# EAGLE design main board (EAGLE 7.1.0)
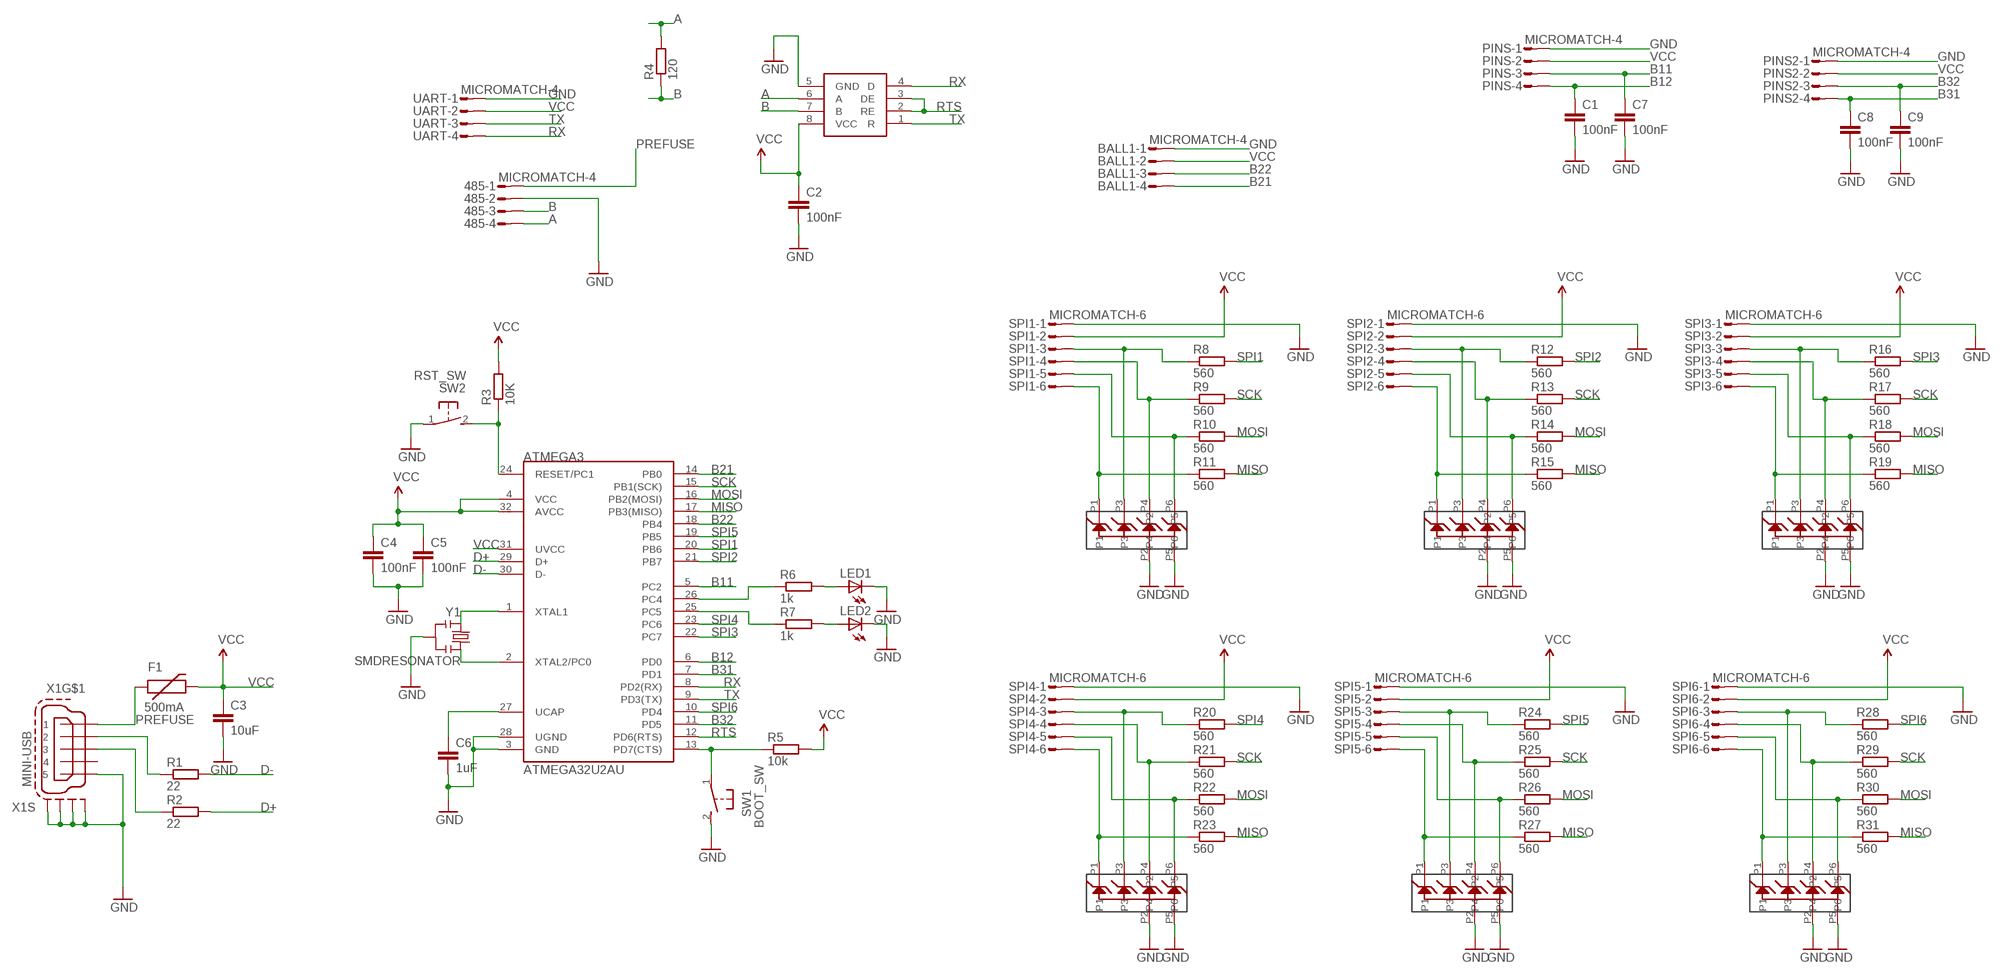
[diagram p0: schematic, sheet 1]

## Parts
485  MICROMATCH-4  [MICROMATCH-4]
ATMEGA3  ATMEGA32U2AU  ATMEGA8U2AU  [TQFP32-08]
BALL1  MICROMATCH-4  [MICROMATCH-4]
C1  100nF  C-EUC0603  [C0603]
C2  100nF  C-EUC0603  [C0603]
C3  10uF  C-EUC1206K  [C1206K]
C4  100nF  C-EUC0603  [C0603]
C5  100nF  C-EUC0603  [C0603]
C6  1uF  C-EUC0603  [C0603]
C7  100nF  C-EUC0603  [C0603]
C8  100nF  C-EUC0603  [C0603]
C9  100nF  C-EUC0603  [C0603]
F1  500mA  PTCSMD  [PTC-1206]
LED1  LEDCHIP-LED0603  [CHIP-LED0603]
LED2  LEDCHIP-LED0603  [CHIP-LED0603]
PINS  MICROMATCH-4  [MICROMATCH-4]
PINS2  MICROMATCH-4  [MICROMATCH-4]
R1  22  R-EU_R0603  [R0603]
R2  22  R-EU_R0603  [R0603]
R3  10K  R-EU_R0603  [R0603]
R4  120  R-EU_R0603  [R0603]
R5  10k  R-EU_R0603  [R0603]
R6  1k  R-EU_R0603  [R0603]
R7  1k  R-EU_R0603  [R0603]
R8  560  R-EU_R0603  [R0603]
R9  560  R-EU_R0603  [R0603]
R10  560  R-EU_R0603  [R0603]
R11  560  R-EU_R0603  [R0603]
R12  560  R-EU_R0603  [R0603]
R13  560  R-EU_R0603  [R0603]
R14  560  R-EU_R0603  [R0603]
R15  560  R-EU_R0603  [R0603]
R16  560  R-EU_R0603  [R0603]
R17  560  R-EU_R0603  [R0603]
R18  560  R-EU_R0603  [R0603]
R19  560  R-EU_R0603  [R0603]
R20  560  R-EU_R0603  [R0603]
R21  560  R-EU_R0603  [R0603]
R22  560  R-EU_R0603  [R0603]
R23  560  R-EU_R0603  [R0603]
R24  560  R-EU_R0603  [R0603]
R25  560  R-EU_R0603  [R0603]
R26  560  R-EU_R0603  [R0603]
R27  560  R-EU_R0603  [R0603]
R28  560  R-EU_R0603  [R0603]
R29  560  R-EU_R0603  [R0603]
R30  560  R-EU_R0603  [R0603]
R31  560  R-EU_R0603  [R0603]
SPI1  MICROMATCH-6  [MICROMATCH-6]
SPI2  MICROMATCH-6  [MICROMATCH-6]
SPI3  MICROMATCH-6  [MICROMATCH-6]
SPI4  MICROMATCH-6  [MICROMATCH-6]
SPI5  MICROMATCH-6  [MICROMATCH-6]
SPI6  MICROMATCH-6  [MICROMATCH-6]
SW1  BOOT_SW  SMD-TACT-3.9X2.9  [SMD-TACT-3.9X2.9]
SW2  RST_SW  SMD-TACT-3.9X2.9  [SMD-TACT-3.9X2.9]
U$1  ESDAXX6LSS  [ESDAXX6L]
U$2  ESDAXX6LSS  [ESDAXX6L]
U$3  ESDAXX6LSS  [ESDAXX6L]
U$4  ESDAXX6LSS  [ESDAXX6L]
U$5  ESDAXX6LSS  [ESDAXX6L]
U$6  ESDAXX6LSS  [ESDAXX6L]
U$7  SN75176BPSR  [SOIC]
UART  MICROMATCH-4  [MICROMATCH-4]
X1  MINI-USB  MINI-USB-SCHIELD-32005-301  [32005-301]
Y1  SMDRESONATOR  SMDRESONATOR45X20  [PBRC-M]

## Nets
A: 485.4 R4.2 U$7.6(A)
B: 485.3 R4.1 U$7.7(B)
B11: ATMEGA3.5(PC2) C7.1 PINS.3
B12: ATMEGA3.6(PD0) C1.1 PINS.4
B21: ATMEGA3.14(PB0) BALL1.4
B22: ATMEGA3.18(PB4) BALL1.3
B31: ATMEGA3.7(PD1) C8.1 PINS2.4
B32: ATMEGA3.11(PD5) C9.1 PINS2.3
D+: ATMEGA3.29(D+) R2.2
D-: ATMEGA3.30(D-) R1.2
GND: 485.2 ATMEGA3.3(GND) ATMEGA3.28(UGND) BALL1.1 C1.2 C2.2 C3.2 C4.2 C5.2 C6.2 C7.2 C8.2 C9.2 LED1.C LED2.C PINS2.1 PINS.1 SPI1.1 SPI2.1 SPI3.1 SPI4.1 SPI5.1 SPI6.1 SW1.2 SW2.1 U$1.P2 U$1.P5 U$2.P2 U$2.P5 U$3.P2 U$3.P5 U$4.P2 U$4.P5 U$5.P2 U$5.P5 U$6.P2 U$6.P5 U$7.5(GND) UART.1 X1.5 X1.M1(S:S1) X1.M2(S:S2) X1.M3(S:S3) X1.M4(S:S4) Y1.2
MISO: ATMEGA3.17(PB3(MISO)) R11.2 R15.2 R19.2 R23.2 R27.2 R31.2
MOSI: ATMEGA3.16(PB2(MOSI)) R10.2 R14.2 R18.2 R22.2 R26.2 R30.2
N$2: R2.1 X1.3
N$3: R1.1 X1.2
N$5: ATMEGA3.1(XTAL1) Y1.1
N$6: ATMEGA3.2(XTAL2/PC0) Y1.3
N$7: ATMEGA3.13(PD7(CTS)) R5.1 SW1.1
N$8: ATMEGA3.24(RESET/PC1) R3.1 SW2.2
N$9: R12.1 SPI2.3 U$2.P3
N$10: R13.1 SPI2.4 U$2.P4
N$11: ATMEGA3.25(PC5) R7.1
N$12: ATMEGA3.27(UCAP) C6.1
N$13: ATMEGA3.26(PC4) R6.1
N$14: LED1.A R6.2
N$15: LED2.A R7.2
N$16: R8.1 SPI1.3 U$1.P3
N$17: R9.1 SPI1.4 U$1.P4
N$18: R10.1 SPI1.5 U$1.P6
N$19: R11.1 SPI1.6 U$1.P1
N$20: R14.1 SPI2.5 U$2.P6
N$21: R15.1 SPI2.6 U$2.P1
N$22: R16.1 SPI3.3 U$3.P3
N$23: R17.1 SPI3.4 U$3.P4
N$24: R18.1 SPI3.5 U$3.P6
N$25: R19.1 SPI3.6 U$3.P1
N$26: R20.1 SPI4.3 U$4.P3
N$27: R21.1 SPI4.4 U$4.P4
N$28: R22.1 SPI4.5 U$4.P6
N$29: R23.1 SPI4.6 U$4.P1
N$30: R24.1 SPI5.3 U$5.P3
N$31: R25.1 SPI5.4 U$5.P4
N$32: R26.1 SPI5.5 U$5.P6
N$33: R27.1 SPI5.6 U$5.P1
N$34: R28.1 SPI6.3 U$6.P3
N$35: R29.1 SPI6.4 U$6.P4
N$36: R30.1 SPI6.5 U$6.P6
N$37: R31.1 SPI6.6 U$6.P1
PREFUSE: 485.1 F1.1 X1.1
RTS: ATMEGA3.12(PD6(RTS)) U$7.2(RE) U$7.3(DE)
RX: ATMEGA3.8(PD2(RX)) U$7.4(D) UART.4
SCK: ATMEGA3.15(PB1(SCK)) R9.2 R13.2 R17.2 R21.2 R25.2 R29.2
SPI1: ATMEGA3.20(PB6) R8.2
SPI2: ATMEGA3.21(PB7) R12.2
SPI3: ATMEGA3.22(PC7) R16.2
SPI4: ATMEGA3.23(PC6) R20.2
SPI5: ATMEGA3.19(PB5) R24.2
SPI6: ATMEGA3.10(PD4) R28.2
TX: ATMEGA3.9(PD3(TX)) U$7.1(R) UART.3
VCC: ATMEGA3.4(VCC) ATMEGA3.31(UVCC) ATMEGA3.32(AVCC) BALL1.2 C2.1 C3.1 C4.1 C5.1 F1.2 PINS2.2 PINS.2 R3.2 R5.2 SPI1.2 SPI2.2 SPI3.2 SPI4.2 SPI5.2 SPI6.2 U$7.8(VCC) UART.2
Unconnected: X1.4

## Library data of the parts
485 BALL1 PINS PINS2 UART = con-amp-micromatch:MICROMATCH-4: MicroMaTch 4 7-215464-4 / 0-215464-4 Drawing Number C-215464 DDEController.pdf; MPN: 7-215464-4; OC_FARNELL: 3784629; OC_NEWARK: 19R8124
ATMEGA3 = SparkFun:ATMEGA8U2: Atmel 8-bit Microcontroller with 8/16/32K Bystes of ISP Flash and USB Controller. ATmega8U2, ATmega16U2, and ATmega32U2
C1-C9 = rcl:C-EU: CAPACITOR, European symbol
F1 = SparkFun-PowerIC:PTC: Resettable Fuse PTC Resettable Fuse. Spark Fun Electronics SKU : COM-08357; PROD_ID: RES-11150
LED1 LED2 = led:LED: LED OSRAM: - CHIPLED LG R971, LG N971, LY N971, LG Q971, LY Q971, LO R971, LY R971 LH N974, LH R974 LS Q976, LO Q976, LY Q976 LO Q996 - Hyper CHIPLED LW Q18S LB Q993, LB Q99A, LB R99A - SideLED LS A670, LO A670, LY A670, LG A670, LP A670 LB A673, LV A673, LT A673, LW A673 LH A674 LY A675 LS A676, LA A676, LO A676, LY A676, LW A676 LS A679, LY A679, LG A679 - Hyper Micro SIDELED® LS Y876, LA Y876, LO Y876, LY Y876 LT Y87S - SmartLED LW L88C, LW L88S LB L89C, LB L89S, LG L890 LS L89K, LO L89K, LY L89K LS L896, LA L896, LO L896, LY L896 - TOPLED LS T670, LO T670, LY T670, LG T670, LP T670 LSG T670, LSP T670, LSY T670, LOP T670, LYG T670 LG T671, LOG T671, LSG T671 LB T673, LV T673, LT T673, LW T673 LH T674 LS T676, LA T676, LO T676, LY T676, LB T676, LH T676, LSB T676, LW T676 LB T67C, LV T67C, LT T67C, LS T67K, LO T67K, LY T67K, LW E67C LS E67B, LA E67B, LO E67B, LY E67B, LB E67C, LV E67C, LT E67C LW T67C LS T679, LY T679, LG T679 LS T770, LO T770, LY T770, LG T770, LP T770 LB T773, LV T773, LT T773, LW T773 LH T774 LS E675, LA E675, LY E675, LS T675 LS T776, LA T776, LO T776, LY T776, LB T776 LHGB T686 LT T68C, LB T68C - Hyper Mini TOPLED® LB M676 - Mini TOPLED Santana® LG M470 LS M47K, LO M47K, LY M47K Source: http://www.osram.convergy.de LUXEON: - LUMILED® LXK2-PW12-R00, LXK2-PW12-S00, LXK2-PW14-U00, LXK2-PW14-V00 LXK2-PM12-R00, LXK2-PM12-S00, LXK2-PM14-U00 LXK2-PE12-Q00, LXK2-PE12-R00, LXK2-PE12-S00, LXK2-PE14-T00, LXK2-PE14-U00 LXK2-PB12-K00, LXK2-PB12-L00, LXK2-PB12-M00, LXK2-PB14-N00, LXK2-PB14-P00, LXK2-PB14-Q00 LXK2-PR12-L00, LXK2-PR12-M00, LXK2-PR14-Q00, LXK2-PR14-R00 LXK2-PD12-Q00, LXK2-PD12-R00, LXK2-PD12-S00 LXK2-PH12-R00, LXK2-PH12-S00 LXK2-PL12-P00, LXK2-PL12-Q00, LXK2-PL12-R00 Source: www.luxeon.com KINGBRIGHT: KA-3528ASYC Source: www.kingbright.com
R1-R31 = rcl:R-EU_: RESISTOR, European symbol
SPI1-SPI6 = con-amp-micromatch:MICROMATCH-6: MicroMaTch 6 7-215464-6 / 0-215464-6 Drawing Number C-215464 DDEController.pdf; MPN: 7-215464-6; OC_FARNELL: 3784630; OC_NEWARK: 19R8125
SW1 SW2 = Erik:SMD-TACT-3.9X2.9: SMD Tactile switch 3.9x2.9 @ebay yayaya168
U$1-U$6 = ESDAXX:ESDAXX6LSS: P1, P3, P4, P6 are for io's P2, P5 are for GND
U$7 = Allan:SN75176BPSR
X1 = con-cypressindustries:MINI-USB-SCHIELD-: MINI USB-B Conector Source: www.cypressindustries.com; OC_FARNELL: unknown; OC_NEWARK: unknown
Y1 = reiko:SMDRESONATOR45X20

## Board
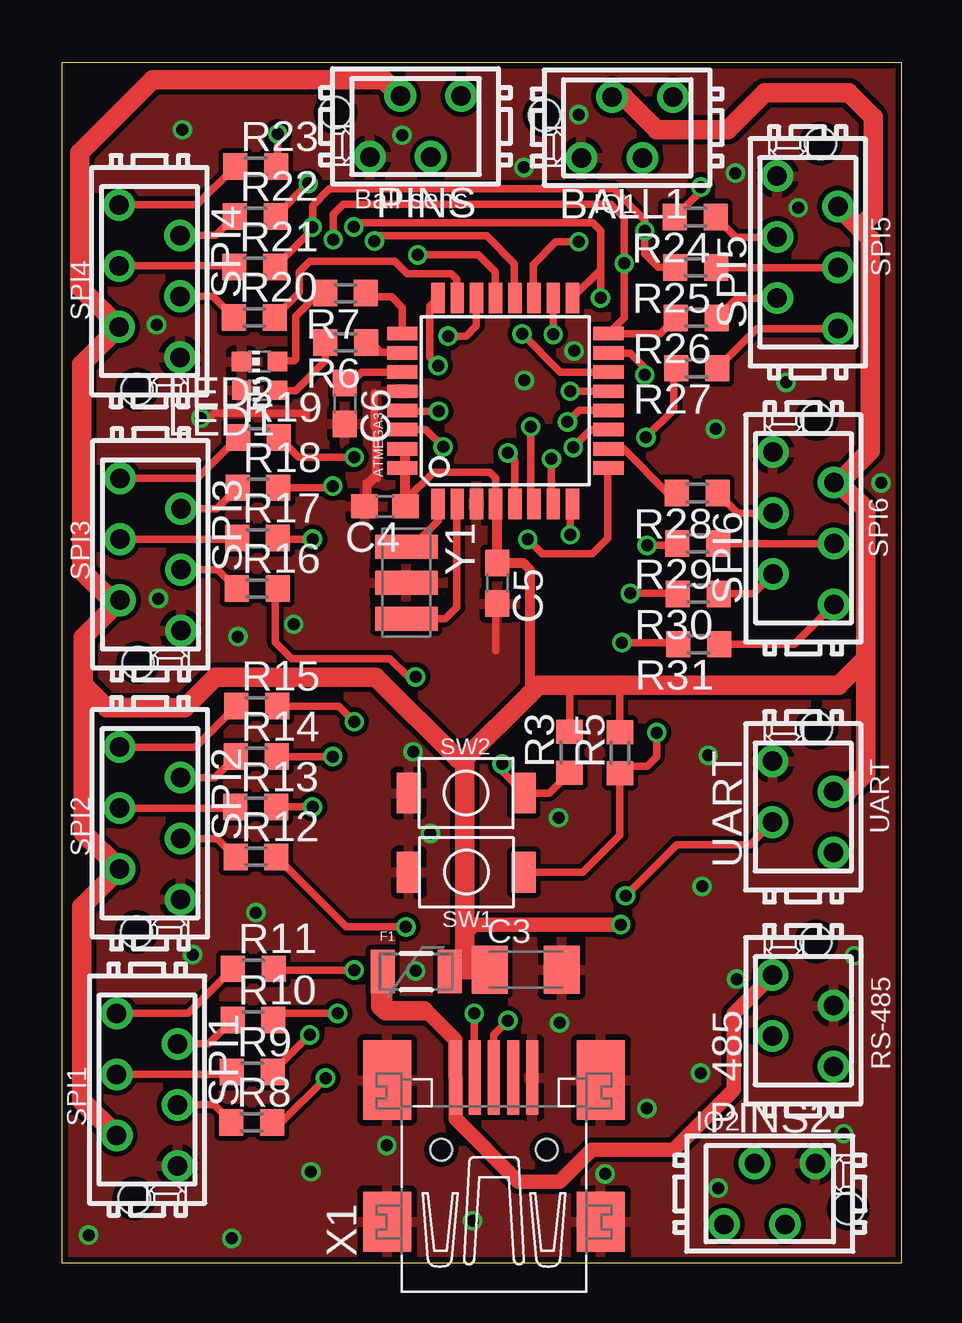
[diagram p1: board, top side]
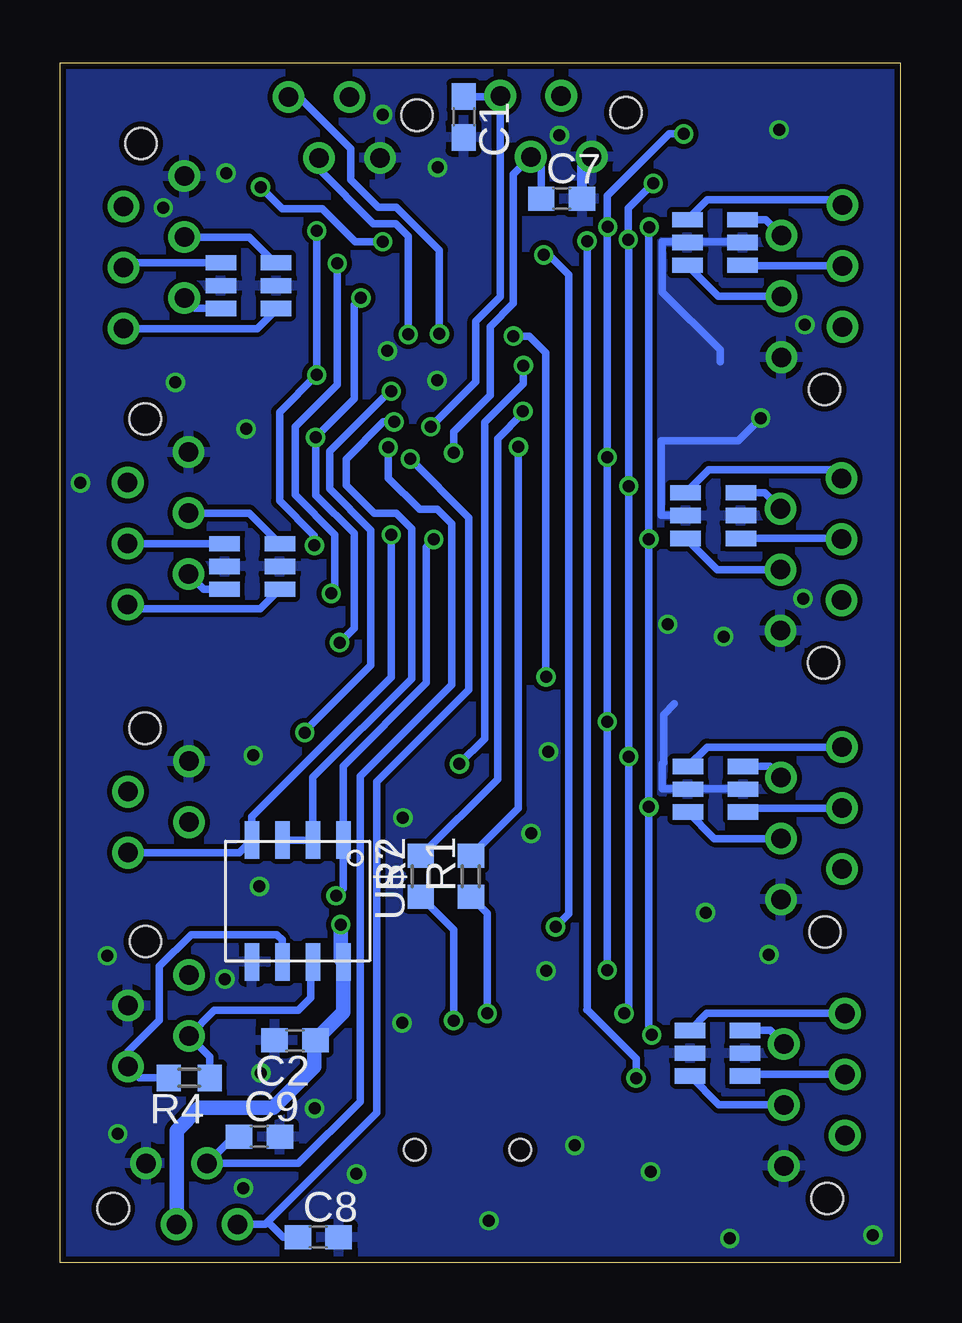
[diagram p2: board, bottom side, seen from below]

Size 35 x 50 mm. Coordinates in mm from the lower left corner, seen from the top.
Outline: 0,0 35,0 35,50 0,50 0,0
Copper layers (1*16): Top 0.035mm / dielectric 1.5mm / Bottom 0.035mm
Design rules "10mils *": minimum track width 6mil, minimum drill 12mil, track to track 8mil, track to pad 8mil, pad to pad 8mil, via to via 8mil, smd to smd 0mil, copper to edge 10mil, drill to drill 10mil, minimum pad ring 10mil, minimum via ring 6mil, stop-mask expansion 2mil, vias tented up to drill 0mil, thermal gap 10mil
Holes 1.3 mm at 31.63,46.65 31.45,35.16 31.46,22.28 31.44,13.4 3.03,2.69 3.12,13.79 3.18,25.01 3.14,36.39 20.13,47.82 11.41,47.94 32.78,2.27

### Footprints (pad centres in the part's own frame; a part is rotated, then mirrored left to right if it is on the bottom)
MICROMATCH-4 = drill 0.813: 1 1.905,1.27; 2 0.635,-1.27; 3 -0.635,1.27; 4 -1.905,-1.27
TQFP32-08 = smd 1.27 x 0.559: 1 -4.293,2.8; 2 -4.293,2; 3 -4.293,1.2; 4 -4.293,0.4; 5 -4.293,-0.4; 6 -4.293,-1.2; 7 -4.293,-2; 8 -4.293,-2.8; 17 4.293,-2.8; 18 4.293,-2; 19 4.293,-1.2; 20 4.293,-0.4; 21 4.293,0.4; 22 4.293,1.2; 23 4.293,2; 24 4.293,2.8 | smd 0.559 x 1.27: 9 -2.8,-4.293; 10 -2,-4.293; 11 -1.2,-4.293; 12 -0.4,-4.293; 13 0.4,-4.293; 14 1.2,-4.293; 15 2,-4.293; 16 2.8,-4.293; 25 2.8,4.293; 26 2,4.293; 27 1.2,4.293; 28 0.4,4.293; 29 -0.4,4.293; 30 -1.2,4.293; 31 -2,4.293; 32 -2.8,4.293
C0603 = smd 1.1 x 1: 1 -0.85,0; 2 0.85,0
C1206K = smd 1.5 x 2: 1 -1.5,0; 2 1.5,0
PTC-1206 = smd 1 x 1.8: 1 -1.4,0; 2 1.4,0
CHIP-LED0603 = smd 0.8 x 0.8: A 0,-0.75; C 0,0.75
R0603 = smd 1 x 1.1: 1 -0.85,0; 2 0.85,0
MICROMATCH-6 = drill 0.813: 1 3.175,1.27; 2 1.905,-1.27; 3 0.635,1.27; 4 -0.635,-1.27; 5 -1.905,1.27; 6 -3.175,-1.27
SMD-TACT-3.9X2.9 = smd 1 x 1.7: 1 -2.4,0; 2 2.4,0
ESDAXX6L = smd 0.635 x 1.27: P1 0,0; P2 0.95,0; P3 1.9,0; P4 1.9,2.3; P5 0.95,2.3; P6 0,2.3
SOIC = smd 1.55 x 0.6: 1 -2.54,1.905; 2 -2.54,0.635; 3 -2.54,-0.635; 4 -2.54,-1.905; 5 2.54,-1.905; 6 2.54,-0.635; 7 2.54,0.635; 8 2.54,1.905
32005-301 = smd 3.1 x 0.5: 1 3,1.6; 2 3,0.8; 3 3,0; 4 3,-0.8; 5 3,-1.6 | smd 2.5 x 2: M1 -3,-4.45; M2 -3,4.45 | smd 3.3 x 2: M3 2.9,4.45; M4 2.9,-4.45 | hole 0.9: 0,2.2; 0,-2.2
PBRC-M = smd 1 x 2.6: 1 -1.5,0; 2 0,0; 3 1.5,0

### Placement (x,y rotation side)
485  30.9,10.09 90 top
ATMEGA3  18.49,35.92 90 top
BALL1  23.57,47.31 180 top
C1  18.18,47.75 270 bottom
C2  25.21,9.28 180 bottom
C3  19.34,12.22 0 top
C4  13.48,31.52 180 top
C5  18.16,28.32 270 top
C6  11.81,35.81 270 top
C7  14.1,44.34 0 bottom
C8  24.24,1.07 0 bottom
C9  26.69,5.26 0 bottom
F1  14.78,12.14 0 top
LED1  8.26,36.36 90 top
LED2  8.25,37.56 90 top
PINS  14.75,47.36 180 top
PINS2  29.51,2.88 0 top
R1  17.88,16.11 90 bottom
R2  19.97,16.11 90 bottom
R3  21.17,21.28 90 top
R4  29.61,7.71 180 bottom
R5  23.27,21.26 90 top
R6  11.84,38.36 180 top
R7  11.83,40.41 180 top
R8  7.93,5.86 0 top
R9  7.95,7.96 0 top
R10  7.98,10.12 0 top
R11  7.99,12.26 0 top
R12  8.1,16.92 0 top
R13  8.09,19 0 top
R14  8.11,21.1 0 top
R15  8.13,23.2 0 top
R16  8.15,28.1 0 top
R17  8.17,30.2 0 top
R18  8.19,32.3 0 top
R19  8.21,34.4 0 top
R20  8.03,39.4 0 top
R21  8.05,41.5 0 top
R22  8.07,43.6 0 top
R23  8.09,45.68 0 top
R24  26.41,43.58 180 top
R25  26.43,41.48 180 top
R26  26.45,39.38 180 top
R27  26.47,37.28 180 top
R28  26.49,32.08 180 top
R29  26.51,29.98 180 top
R30  26.53,27.88 180 top
R31  26.55,25.78 180 top
SPI1  3.57,7.22 270 top
SPI2  3.69,18.32 270 top
SPI3  3.71,29.52 270 top
SPI4  3.67,40.91 270 top
SPI5  31.09,42.11 90 top
SPI6  30.91,30.61 90 top
SW1  16.87,16.28 180 top
SW2  16.86,19.58 0 top
U$1  8.75,9.69 270 bottom
U$2  8.84,20.69 270 bottom
U$3  8.93,32.09 270 bottom
U$4  8.86,43.47 270 bottom
U$5  26,39.77 90 bottom
U$6  25.84,28.07 90 bottom
U$7  25.1,15.08 270 bottom
UART  30.9,19 90 top
X1  18.02,4.72 90 top
Y1  14.37,28.35 270 top

### Tracks (layer width: path | path; a pad name or v marks a point on that pad's centre or on a via)
A
  Bottom 0.305: 25.73,12.06 U$7.6 25.75,12.55 25.75,13.46 25.97,13.68 29.54,13.68 30.86,12.36 30.86,10.11 32.17,8.8 485.4 31.7,7.71 R4.2
B
  Bottom 0.305: 24.46,11.94 U$7.7 24.55,12.46 24.55,11.05 25.08,10.52 28.57,10.52 485.3 28.76,8.59 R4.1
B11  (via drill 0.5)
  Top 0.305: v18.6,33.75 18.89,33.46 ATMEGA3.5
  Bottom 0.305: v18.6,33.75 18.6,34.63 17.08,36.15 17.08,39.01 16.11,39.98 16.11,45.37 PINS.3 14.95,45.66 C7.1
B12  (via drill 0.5)
  Top 0.305: ATMEGA3.6 19.55,31.79 v19.55,34.84
  Bottom 0.305: 16.71,48.58 PINS.4 | v19.55,34.84 17.67,36.72 17.67,39.24 16.66,40.26 PINS.4 | C1.1 16.68,48.6 PINS.4
B21  (via drill 0.5)
  Top 0.305: ATMEGA3.14 20.78,37.12 v19.19,38.71
  Bottom 0.305: v19.19,38.71 19.19,42.2 20.98,43.99 21.73,43.99 22.88,45.14 22.88,46.42 25.04,48.58 BALL1.4
B22  (via drill 0.5)
  Top 0.305: ATMEGA3.18 v20.49,38.69
  Bottom 0.305: v20.49,38.69 20.49,42.78 21.02,43.31 21.94,43.31 24.2,45.58 BALL1.3
B31  (via drill 0.5)
  Top 0.305: ATMEGA3.7 20.41,31.71 v20.41,33.5
  Bottom 0.305: 26.34,1.72 21.8,6.26 21.8,20.05 17.96,23.89 17.96,31.05 v20.41,33.5 | 26.34,1.72 26.45,1.61 PINS2.4 | C8.1 25.69,1.07 26.34,1.72
B32  (via drill 0.5)
  Top 0.305: ATMEGA3.11 22.06,34.72 v21.32,33.98
  Bottom 0.305: v21.32,33.98 21.32,32.7 20.02,31.4 19.28,31.4 18.67,30.79 18.67,24.09 22.49,20.27 22.49,6.72 25.07,4.15 PINS2.3 27.77,5.26 C9.1
D+  (via drill 0.5)
  Top 0.305: v15.71,35.49 14.23,35.49 ATMEGA3.29
  Bottom 0.305: v15.71,35.49 15.71,35.41 16.77,34.35 16.77,20.16 R2.2
D-  (via drill 0.5)
  Top 0.305: v15.9,34 15.18,34.72 ATMEGA3.30
  Bottom 0.305: v15.9,34 15.9,18.94 R1.2
GND  (via drill 0.5)
  Top 0.305: C5.2 18.1,27.41 18.1,25.5 | ATMEGA3.28 14.13,36.25 | 12.7,32.45 12.7,32.5 | 12.7,32.45 12.7,31.59 C4.2 12.75,31.64 12.75,32.4 13.05,32.7 13.15,32.7 13.1,32.75 13.1,34.85 13.05,34.8 | 12.7,32.45 13.1,32.85 13.1,34.8 13.04,34.86 13.04,36.24 13.05,36.25 | 10.2,35.2 10.2,35.45 10.15,35.4 6.35,35.4 6.15,35.2 v5.8,35.2
  Bottom 0.305: U$3.P2 9.95,31.15 9.95,34.25 6.75,34.25 v5.8,35.2 | U$4.P5 6.59,42.55 9.9,42.55 9.9,40.45 7.5,38.05 LED2.C | U$2.P5 9.9,19.75 9.9,20.8 9.85,20.85 9.85,22.85 9.4,23.3
  Bottom 0.406: C7.2 13.25,45.69 PINS.1
  other vias: 7.35,26.1 15.37,17.9 20.71,18.55 13.55,4.9 33.03,12.8 10.39,3.8 22.65,3.71 27.36,3.12 7.09,1.02 28.08,45.41 30.19,36.69 5.46,12.85 20.75,10 9.68,26.61 28.13,11.83 26.63,7.91 32.59,5.38 34.15,32.5 14.19,46.99 4.04,27.68 27.25,34.75 26.95,21.15 14.75,12.17 8.1,14.6 26.69,15.69 3.96,39.09 21.36,38 19.27,45.65 5.04,47.22 19.29,36.77 14.65,21.3 21.55,47.85 30.7,43.97 1.13,1.16 24.39,6.44 17.13,1.76
  pour Bottom: 0,0 35,0 35,50 0,50
  pour Top: 0,0 35,0 35,50 0,50
MISO  (via drill 0.5)
  Top 0.305: R11.2 8.9,12.2 v12.2,12.2 | 9.21,34.25 R19.2 9.89,33.57 v12.2,33.57 | R27.2 25.62,37.58 25.5,37.46 25.5,35.55 v24.35,34.4 | v23.35,25.85 25.63,25.85 R31.2 | R23.2 8.9,45.72 9,45.82 v9,47.03 v9.01,47.04 | ATMEGA3.17 22.46,41.38 | 22.46,41.38 22.46,43.01 22.13,43.34 12.35,43.34 v12.18,43.17 | v22.46,40.21 22.46,41.38 | R15.2 11.55,23.2 v12.2,22.55
  Bottom 0.305: v23.35,25.85 22.75,26.45 22.75,30.4 24.34,31.99 v24.34,34.39 v24.35,34.4 22.75,36 22.75,39.92 v22.46,40.21 22.7,39.98 | v12.2,12.2 v12.2,22.55 v12.2,33.57 12.2,43.15 v12.18,43.17 v12.19,43.18 12.19,44.47 9.62,47.04 v9.01,47.04
MOSI  (via drill 0.5)
  Top 0.305: R10.2 9.11,10.4 v11.5,10.4 | R14.2 v11.3,21.1 | R30.2 25.66,27.9 v23.7,27.9 | ATMEGA3.16 22.97,38.72 | ATMEGA3.16 23.45,39.39 v23.45,41.65 23.45,43.55 22.89,44.11 11.73,44.11 11.32,43.7 v11.32,42.64 | R26.2 24.94,38.72 ATMEGA3.16 | R22.2 8.92,43.62 v10.28,44.98 | R18.2 11.23,32.3 v11.3,32.37
  Bottom 0.305: v11.5,10.4 11.4,10.4 11.3,10.5 v11.3,21.1 v11.3,32.37 11.3,32.91 11.3,42.62 v11.32,42.64 11.32,43.94 v10.28,44.98 | v23.45,41.65 23.45,36.6 25.2,34.85 25.2,32 23.55,30.35 23.55,28.05 v23.7,27.9
N$2  (via drill 0.5)
  Top 0.305: X1.3 18,7.74 18,9.5 v18.6,10.1
  Bottom 0.305: 18.6,10.6 v18.6,10.1 18.6,13.89 R2.1
N$3  (via drill 0.5)
  Top 0.305: X1.2 17.2,7.74 v17.2,10.4
  Bottom 0.305: 17.2,10.6 v17.2,10.4 17.2,14.58 R1.1
N$5
  Top 0.305: ATMEGA3.1 15.69,30.93 14.61,29.85 Y1.1
N$6
  Top 0.305: ATMEGA3.2 16.47,31.61 16.47,27.33 15.99,26.85 Y1.3
N$7  (via drill 0.5)
  Top 0.305: 23.3,20.38 R5.1 | R5.1 23.56,20.7 24.4,20.7 24.8,21.1 v24.8,22.1 | SW1.1 21.72,16.28 23.27,17.83 R5.1 | ATMEGA3.13 v21.2,36.32
  Bottom 0.305: v24.8,22.1 24.8,22.15 22.05,24.9 22.05,30.53 23.77,32.25 23.77,33.82 21.27,36.32 v21.2,36.32
N$8  (via drill 0.5)
  Top 0.305: R3.1 20.32,19.58 SW2.2 18.36,20.48 v18.36,20.79 | ATMEGA3.24 15.34,39.86 15.34,37.74 v15.69,37.39
  Bottom 0.305: v15.69,37.39 15.69,36.63 15.7,36.63 17.3,35.03 17.3,21.85 v18.36,20.79
N$9
  Top 0.305: R12.1 6.49,17.68 SPI2.3
  Bottom 0.305: U$2.P3 7.74,17.68 SPI2.3
N$10
  Top 0.305: R13.1 7.2,18.95 SPI2.4
  Bottom 0.305: U$2.P4 6.38,18.95 SPI2.4
N$11
  Top 0.305: ATMEGA3.25 14.2,39.8 13.75,40.25 12.84,40.25 R7.1
N$12
  Top 0.305: ATMEGA3.27 12.52,37.12 12.06,36.66 C6.1
N$13
  Top 0.305: R6.1 12.89,38.36 13.3,37.95 14.17,37.95 ATMEGA3.26
N$14
  Top 0.305: 10.99,37.79 R6.2 10.99,37.59 9.75,36.35 LED1.A
N$15
  Top 0.305: R7.2 10.71,40.41 9.75,39.45 9.75,37.65 9.7,37.6 9.04,37.6 LED2.A
N$16
  Top 0.305: R8.1 6.36,6.58 SPI1.3
  Bottom 0.305: U$1.P3 7.54,6.58 SPI1.3
N$17
  Top 0.305: R9.1 7,7.86 SPI1.4
  Bottom 0.305: U$1.P4 6.38,7.86 SPI1.4
N$18
  Top 0.305: R10.1 6.13,9.12 SPI1.5
  Bottom 0.305: U$1.P6 5.41,9.69 SPI1.5
N$19
  Top 0.305: R11.1 5.28,10.39 SPI1.6
  Bottom 0.305: U$1.P1 8.04,10.39 SPI1.6
N$20
  Top 0.305: R14.1 6.38,20.23 SPI2.5
  Bottom 0.305: U$2.P6 5.42,20.69 SPI2.5
N$21
  Top 0.305: R15.1 5.58,21.5 SPI2.6
  Bottom 0.305: U$2.P1 8.04,21.5 SPI2.6
N$22
  Top 0.305: R16.1 6.51,28.89 SPI3.3
  Bottom 0.305: U$3.P3 7.62,28.89 SPI3.3
N$23
  Top 0.305: R17.1 7.28,30.16 SPI3.4
  Bottom 0.305: U$3.P4 2.48,30.19 SPI3.4
N$24
  Top 0.305: R18.1 6.46,31.43 SPI3.5
  Bottom 0.305: U$3.P6 5.64,32.09 SPI3.5
N$25
  Top 0.305: R19.1 5.66,32.7 SPI3.6
  Bottom 0.305: U$3.P1 7.97,33.05 2.79,33.05 SPI3.6
N$26
  Top 0.305: R20.1 6.3,40.27 SPI4.3
  Bottom 0.305: U$4.P3 7.57,40.27 SPI4.3
N$27
  Top 0.305: R21.1 7.16,41.55 SPI4.4
  Bottom 0.305: U$4.P4 6.54,41.55 SPI4.4
N$28
  Top 0.305: R22.1 6.43,42.81 SPI4.5
  Bottom 0.305: U$4.P6 5.59,43.47 SPI4.5
N$29
  Top 0.305: R23.1 5.64,44.09 SPI4.6
  Bottom 0.305: U$4.P1 8.03,44.3 2.62,44.3 SPI4.6
N$30
  Top 0.305: R24.1 28.09,42.74 SPI5.3
  Bottom 0.305: SPI5.3 27.12,42.74 26.05,41.67 U$5.P3
N$31
  Top 0.305: R25.1 SPI5.4
  Bottom 0.305: SPI5.4 32.16,41.67 U$5.P4
N$32
  Top 0.305: R26.1 28.12,40.2 SPI5.5
  Bottom 0.305: 29.8,40.19 SPI5.5 29.39,39.77 U$5.P6
N$33
  Top 0.305: R27.1 28.98,38.94 SPI5.6
  Bottom 0.305: SPI5.6 26.79,38.94 26,39.72 U$5.P1
N$34
  Top 0.305: R28.1 28.18,31.25 SPI6.3
  Bottom 0.305: U$6.P3 27.11,31.25 SPI6.3
N$35
  Top 0.305: R29.1 SPI6.4
  Bottom 0.305: U$6.P4 SPI6.4
N$36
  Top 0.305: R30.1 28.82,27.88 SPI6.5
  Bottom 0.305: U$6.P6 29,28.07 SPI6.5
N$37
  Top 0.305: R31.1 30.52,25.78 SPI6.6
  Bottom 0.305: U$6.P1 26.66,27.25 32,27.25 SPI6.6
PREFUSE
  Top 0.61: 15.1,10.5 15.2,10.5 16.4,9.3 16.4,7.74 X1.1 16.42,6 19.03,3.39 20.76,3.39 22.09,4.72 25.5,4.72 28,7.22 28,10.37 28.02,10.38 28.99,11.35 485.1
  Top 0.813: 15.1,10.5 13.6,10.5 | 13.6,10.5 13.5,10.5 13.3,10.7 13.3,12.11 | F1.1 13.38,10.72 13.6,10.5
RTS  (via drill 0.5)
  Top 0.305: ATMEGA3.12 21.57,35.53 v21.08,35.04
  Bottom 0.305: 24.5,17.66 U$7.2 | U$7.2 U$7.3 | U$7.2 24.46,20.23 20.35,24.35 20.35,30.6 20.99,31.24 21.91,31.24 23.08,32.41 23.08,33.49 21.53,35.04 v21.08,35.04
RX  (via drill 0.5)
  Top 0.305: ATMEGA3.8 21.4,31.52 | 21.3,31.62 ATMEGA3.8 | ATMEGA3.8 21.2,31.54 v21.2,30.34
  Bottom 0.305: U$7.4 | U$7.4 27.53,17.09 UART.4 | U$7.4 27,18.59 21.2,24.4 v21.2,30.34
SCK  (via drill 0.5)
  Top 0.305: R29.2 25.58,29.9 v24.4,29.9 | R9.2 v10.34,9.5 | ATMEGA3.15 22.8,37.9 23.7,37.9 24.3,37.3 v24.3,37 | R25.2 24.87,41.48 24.3,42.05 v24.3,43 24.3,43.45 23,44.75 11.15,44.75 10.46,44.06 v10.46,43.17 v10.45,43.16 10.45,43.05 R21.2 9.2,41.5 | R13.2 v10.46,19 | R17.2 9.06,30.16 v10.46,30.16
  Bottom 0.305: v24.3,43 v24.3,37 25.85,35.45 25.85,31.75 24.4,30.3 v24.4,29.9 | v10.34,9.5 10.46,9.62 v10.46,19 v10.46,30.16 v10.46,43.15 v10.45,43.16
SPI1  (via drill 0.5)
  Top 0.305: R8.2 9.16,5.86 v11,7.7 | 18.85,40.25 ATMEGA3.20 18.87,40.23 18.87,41.63 17.71,42.79 13.25,42.79 v13.04,42.58
  Bottom 0.305: v11,7.7 11,8.5 13.04,10.54 | 13.04,10.54 13.05,10.55 | v13.04,42.58 13.04,10.54
SPI2  (via drill 0.5)
  Top 0.305: R12.2 11.87,14 v14.35,14 | 18.2,40.32 ATMEGA3.21 18.07,40.23 18.07,41.29 17.36,42 v14.84,42
  Bottom 0.305: v14.35,14 13.8,14.55 13.8,41.17 14.63,42 v14.84,42
SPI3  (via drill 0.5)
  Top 0.305: 17.25,40.25 ATMEGA3.22 | 17.28,40.22 ATMEGA3.22 | ATMEGA3.22 17.29,39.05 16.86,38.62 v16.11,38.62 | R16.2 8.91,28.01 8.91,25.86 9.59,25.18 13.68,25.18 14.44,24.42 v14.75,24.42
  Bottom 0.305: v16.11,38.62 15.45,38.62 14.76,37.93 v14.76,24.43 v14.75,24.42
SPI4
  Top 0.305: R20.2 9.9,40.42 9.9,41.3 10.34,41.74 13.88,41.74 14.4,41.22 16.23,41.22 16.46,40.99 16.46,40.24 ATMEGA3.23 16.47,40.23
SPI5  (via drill 0.5)
  Top 0.305: ATMEGA3.19 19.65,40.25 19.65,41.6 20.6,42.55 v21.55,42.55 | v26.64,44.83 26.64,44.66 R24.2
  Bottom 0.305: v21.55,42.55 22.69,42.55 24.07,43.93 25.74,43.93 v26.64,44.83
SPI6
  Top 0.305: 22.81,33.95 ATMEGA3.10 23.43,33.92 25.27,32.08 R28.2
TX  (via drill 0.5)
  Top 0.305: UART.3 28.7,17.43 25.64,17.43 v23.5,15.3 | ATMEGA3.9 22.76,33.1 22.76,30.2 22.11,29.55 20.03,29.55 v19.43,30.15
  Bottom 0.305: v23.5,15.3 23.2,15.6 U$7.1 23.2,20.7 19.73,24.16 19.73,29.82 19.43,30.12 v19.43,30.15
VCC  (via drill 0.5)
  Top 0.305: 14.33,31.73 14.33,31.78 15.5,32.95 17.85,32.95 18.1,32.7 ATMEGA3.4 | R3.2 21.17,24.03 21.12,24.08 | R5.2 23.27,23.89 23.08,24.08
  Top 0.406: 14.33,33.79 14.33,31.73 C4.1 | 14.33,33.79 ATMEGA3.31 | ATMEGA3.4 18.16,31.56 C5.1 19.23,29.17 19.5,28.9 19.5,23.7 19.6,23.6 | 14.33,33.79 14.33,33.97 14.3,34 14.3,33.22 ATMEGA3.32
  Top 0.61: v23.3,14.1 17.2,14.1 16.8,13.7
  Top 0.813: C3.1 16.21,12.22 | 16.8,21 16.8,13.7 16.8,12.81 16.21,12.22 | 16.8,21 16.5,21 13.1,24.4 6.4,24.4 5.13,23.13 1.88,23.13 0.9,24.11 | 32.38,32.52 33.7,33.84 33.7,42.67 33.24,43.13 | SPI6.2 32.38,32.52 | 32.38,32.52 33.5,31.39 33.5,25.2 | UART.2 32.73,19.64 33.5,20.4 33.5,25.2 | 33.24,43.13 SPI5.2 | SPI1.2 0.85,6.76 0.85,14.85 SPI2.2 0.9,17.93 0.9,24.11 | 0.9,24.11 0.9,26.07 SPI3.2 2.08,27.61 0.85,28.85 0.85,37.45 SPI4.2 0.75,40.66 0.75,46.25 3.81,49.31 13.44,49.31 PINS.2 | 16.21,12.22 16.21,12.17 F1.2 | 33.5,25.2 32.38,24.08 23.08,24.08 21.12,24.08 19.88,24.08 19.5,23.7 16.8,21 | BALL1.2 23.44,48.58 24.8,47.22 27.76,47.22 29.3,48.76 32.81,48.76 33.83,47.74 33.83,43.72 33.24,43.13
  Bottom 0.305: U$7.8
  Bottom 0.406: 23.2,14 v23.3,14.1
  Bottom 0.61: v23.3,14.1 23.3,12.64 U$7.8 23.2,10.45 C2.1 24.4,9.24 24.4,8.18 26.12,6.46 29.2,6.46 30.14,5.51 PINS2.2

### Text on the board
tSilk: Ball-sens | IO1 | SPI4 | SPI5 | SPI3 | SPI6 | SPI2 | UART | SPI1 | RS-485 | IO2